# Altium schematic sheet Sheet1.SchDoc
size A4
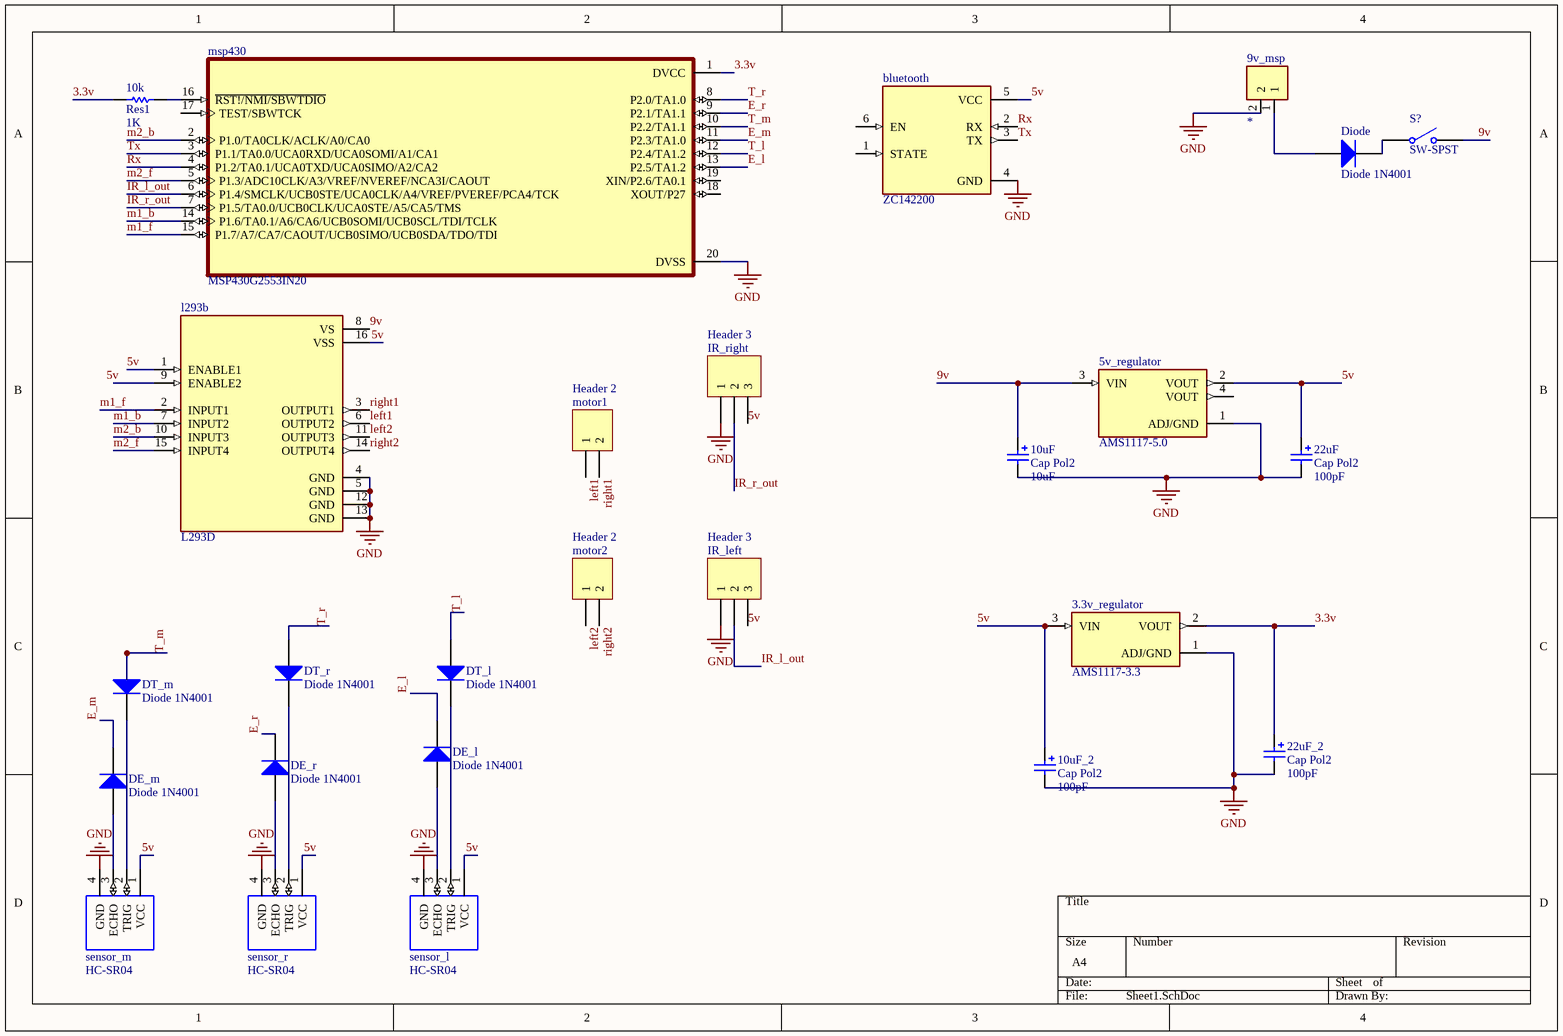
[diagram p0: Sheet1.SchDoc]

## Parts
3.3v_regulator  AMS1117-3.3  [SOT229P700X180-4N]
5v_regulator  AMS1117-5.0  [SOT229P700X180-4N]
9v_msp  282836-2  [CONN_282836-2]  (value not drawn)
10k  Res1  value 1K  [AXIAL-0.3]
10uF  Cap Pol2  value 10uF  [POLAR0.8]
10uF_2  Cap Pol2  value 100pF  [POLAR0.8]
22uF  Cap Pol2  value 100pF  [POLAR0.8]
22uF_2  Cap Pol2  value 100pF  [POLAR0.8]
bluetooth  ZC142200  [MODULE_ZC142200]
DE_l  Diode 1N4001  [DO-41]
DE_m  Diode 1N4001  [DO-41]
DE_r  Diode 1N4001  [DO-41]
Diode  Diode 1N4001  [DO-41]
DT_l  Diode 1N4001  [DO-41]
DT_m  Diode 1N4001  [DO-41]
DT_r  Diode 1N4001  [DO-41]
IR_left  Header 3  [HDR1X3]
IR_right  Header 3  [HDR1X3]
l293b  L293D  [DIP880W50P254L2000H510Q16]
motor1  Header 2  [HDR1X2]
motor2  Header 2  [HDR1X2]
msp430  MSP430G2553IN20  [DIP794W45P254L2692H508Q20]
S?  SW-SPST  [SPST-2]
sensor_l  HC-SR04  [XCVR_HC-SR04]
sensor_m  HC-SR04  [XCVR_HC-SR04]
sensor_r  HC-SR04  [XCVR_HC-SR04]

## Nets
GND: 3.3v_regulator.1(ADJ/GND) 5v_regulator.1(ADJ/GND) 9v_msp.2 10uF.2 10uF_2.2 22uF.2 22uF_2.2 bluetooth.4(GND) IR_left.1 IR_right.1 l293b.4(GND) l293b.5(GND) l293b.12(GND) l293b.13(GND) msp430.20(DVSS) sensor_l.4(GND) sensor_m.4(GND) sensor_r.4(GND)
3.3v: 3.3v_regulator.2(VOUT) 10k.1 22uF_2.1 msp430.1(DVCC)
5v: 3.3v_regulator.3(VIN) 5v_regulator.2(VOUT) 10uF_2.1 22uF.1 bluetooth.5(VCC) IR_left.3 IR_right.3 l293b.1(ENABLE1) l293b.9(ENABLE2) l293b.16(VSS) sensor_l.1(VCC) sensor_m.1(VCC) sensor_r.1(VCC)
9v: 5v_regulator.3(VIN) 10uF.1 l293b.8(VS) S?.2(NO)
E_l: DE_l.2(K) msp430.13(P2.5/TA1.2)
E_m: DE_m.2(K) msp430.11(P2.3/TA1.0)
E_r: DE_r.2(K) msp430.9(P2.1/TA1.1)
IR_l_out: IR_left.2 msp430.6(P1.4/SMCLK/UCB0STE/UCA0CLK/A4/VREF/PVEREF/PCA4/TCK)
IR_r_out: IR_right.2 msp430.7(P1.5/TA0.0/UCB0CLK/UCA0STE/A5/CA5/TMS)
left1: l293b.6(OUTPUT2) motor1.1
left2: l293b.11(OUTPUT3) motor2.1
m1_b: l293b.7(INPUT2) msp430.14(P1.6/TA0.1/A6/CA6/UCB0SOMI/UCB0SCL/TDI/TCLK)
m1_f: l293b.2(INPUT1) msp430.15(P1.7/A7/CA7/CAOUT/UCB0SIMO/UCB0SDA/TDO/TDI)
m2_b: l293b.10(INPUT3) msp430.2(P1.0/TA0CLK/ACLK/A0/CA0)
m2_f: l293b.15(INPUT4) msp430.5(P1.3/ADC10CLK/A3/VREF/NVEREF/NCA3I/CAOUT)
right1: l293b.3(OUTPUT1) motor1.2
right2: l293b.14(OUTPUT4) motor2.2
Rx: bluetooth.2(RX) msp430.4(P1.2/TA0.1/UCA0TXD/UCA0SIMO/A2/CA2)
T_l: DT_l.1(A) msp430.12(P2.4/TA1.2)
T_m: DT_m.1(A) msp430.10(P2.2/TA1.1)
T_r: DT_r.1(A) msp430.8(P2.0/TA1.0)
Tx: bluetooth.3(TX) msp430.3(P1.1/TA0.0/UCA0RXD/UCA0SOMI/A1/CA1)
Net9v_msp_1: 9v_msp.1 Diode.1(A)
Net10k_2: 10k.2 msp430.16(~{RST!/NMI/SBWTDIO})
NetDE_l_1: DE_l.1(A) sensor_l.3(ECHO)
NetDE_m_1: DE_m.1(A) sensor_m.3(ECHO)
NetDE_r_1: DE_r.1(A) sensor_r.3(ECHO)
NetDiode_2: Diode.2(K) S?.1(COMMON)
NetDT_l_2: DT_l.2(K) sensor_l.2(TRIG)
NetDT_m_2: DT_m.2(K) sensor_m.2(TRIG)
NetDT_r_2: DT_r.2(K) sensor_r.2(TRIG)

Not connected (* = marked no-connect by the designer): 5v_regulator 4(VOUT); bluetooth 1(STATE) 6(EN); msp430 17(TEST/SBWTCK) 18(XOUT/P27) 19(XIN/P2.6/TA0.1)

## Library data of the parts
3.3v_regulator = AMS1117-3.3: Sot223/Pkg 1-Amp 3.3-Volt Low Drop Out Voltage Regulatator; MF: Advanced Monolithic Systems; Price: None; Package: None; Value: *; MP: AMS1117-3.3; Availability: Unavailable; SnapEDA_Link: https://www.snapeda.com/parts/AMS1117-3.3/Advanced%20Monolithic%20Systems/view-part/53450/?ref=snap
5v_regulator = AMS1117-5.0: Sot223/Pkg 1-Amp 5-Volt Low Drop Out Voltage Regulatator; MF: Advanced Monolithic Systems; Package: None; SnapEDA_Link: https://www.snapeda.com/parts/AMS1117-5.0/Advanced%20Monolithic%20Systems/view-part/184433/?ref=snap; Price: None; Availability: Unavailable; MP: AMS1117-5.0; Value: *
9v_msp = 282836-2: Connector, Terminal Block; Wire Receptacle; 2 Pos.; 16-30 AWG; 0.197 in. CL; Sid; Centerline_Pitch: 5 mm[.197 in]; MF: TE Connectivity; Number_of_Positions: 2; MP: 282836-2; Availability: Unavailable; EU_RoHS_Compliance: Compliant with Exemptions; Package: None; Value: *; TE_purchase_URL: https://www.te.com/usa-en/product-282836-2.html?te_bu=Cor&te_type=disp&te_campaign=seda_glo_cor-seda-global-disp-prtnr-fy19-seda-model-bom-cta_sma-317_1&elqCampaignId=32493; Price: None; SnapEDA_Link: https://www.snapeda.com/parts/282836-2/TE%20Connectivity%20AMP%20Connectors/view-part/492233/?ref=snap; Comment_1: *
10k = Res1: Resistor; Published: 8-Jun-2000; LatestRevisionDate: 17-Jul-2002; LatestRevisionNote: Re-released for DXP Platform.; PackageReference: AXIAL-0.3; Publisher: Altium Limited; PackageDescription: Axial Device, Thru-Hole; 2 Leads; 0.3 in Pin Spacing
10uF 10uF_2 22uF 22uF_2 = Cap Pol2: Polarized Capacitor (Axial); Published: 8-Jun-2000; LatestRevisionDate: 17-Jul-2002; LatestRevisionNote: Re-released for DXP Platform.; PackageReference: POLAR0.8; Publisher: Altium Limited; PackageDescription: Polarized Capacitor; 2 Leads
bluetooth = ZC142200: 1pc HC-05 6 Pin Wireless Bluetooth RF Transceiver Module Serial For Arduino; MF: YKS; MP: ZC142200; Availability: Unavailable; SnapEDA_Link: https://www.snapeda.com/parts/ZC142200/YKS/view-part/618924/?ref=snap; Value: *; Price: None; Package: None
DE_l DE_m DE_r Diode DT_l DT_m DT_r = Diode 1N4001: 1 Amp General Purpose Rectifier; Published: 8-Jun-2000; LatestRevisionDate: 17-Jul-2002; LatestRevisionNote: Re-released for DXP Platform.; DatasheetVersion: 1998; PackageVersion: Aug-1999; PackageReference: DO-41; Publisher: Altium Limited; PackageDescription: Diode, Axial; Body 5.2 x 2.7 mm (LxDia. max), Lead Dia. 0.86 mm (max); Code_JEDEC: DO-204-AL; ComponentLink1Description: Manufacturer Link; ComponentLink1URL: http://www.fairchildsemi.com/; ComponentLink2Description: Datasheet; ComponentLink2URL: http://www.fairchildsemi.com/ds/1N%2F1N4001.pdf
IR_left IR_right = Header 3: Header, 3-Pin; LatestRevisionDate: 17-Jul-2002; LatestRevisionNote: Re-released for DXP Platform.; Publisher: Altium Limited
l293b = L293D: Bipolar Motor Driver Parallel 16-PowerDIP; MF: STMicroelectronics; Availability: Unavailable; SnapEDA_Link: https://www.snapeda.com/parts/L293D/STMicroelectronics/view-part/83726/?ref=snap; MP: L293D; Price: None; Package: SOIC-20 STMicroelectronics; Value: *
motor1 motor2 = Header 2: Header, 2-Pin; LatestRevisionDate: 17-Jul-2002; LatestRevisionNote: Re-released for DXP Platform.; Publisher: Altium Limited
msp430 = MSP430G2553IN20: MSP430 MSP430G2xx Microcontroller IC 16-Bit 16MHz 16KB _16K x 8_ FLASH 20-PDIP; MF: Texas Instruments; Package: PDIP-20 Texas Instruments; Availability: Unavailable; Value: *; MP: MSP430G2553IN20; SnapEDA_Link: https://www.snapeda.com/parts/MSP430G2553IN20/Texas%20Instruments/view-part/46372/?ref=snap; Price: None
S? = SW-SPST: Single-Pole, Single-Throw Switch; Published: 24-Mar-1999; LatestRevisionDate: 17-Jul-2002; LatestRevisionNote: Re-released for DXP Platform.; PackageReference: SPST-2; Publisher: Altium Limited; PackageDescription: Switch; 2 Leads
sensor_l sensor_m sensor_r = HC-SR04: HC-SR04 Ultrasonic Sensor Platform Evaluation Expansion Board; MF: SparkFun Electronics; Value: *; SnapEDA_Link: https://www.snapeda.com/parts/HC-SR04/SparkFun%20Electronics/view-part/341106/?ref=snap; MP: HC-SR04; Availability: Unavailable; Price: None; Package: None